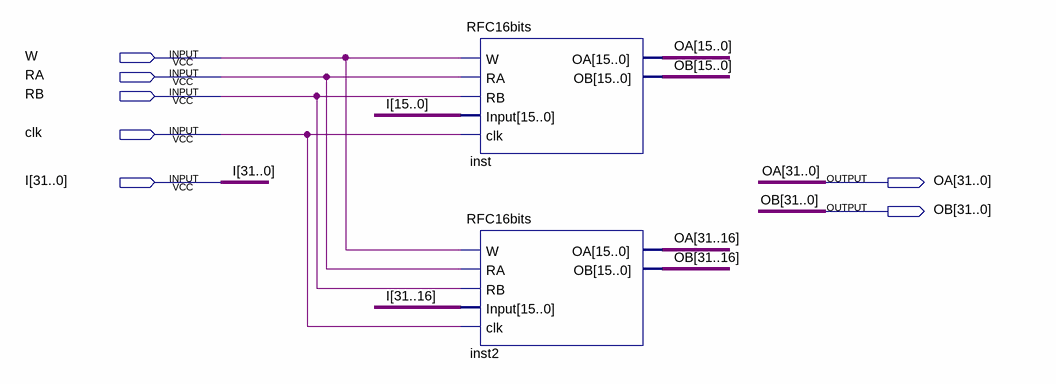
[diagram p0: schematic sheet]
// Quartus schematic RFC32bits.bdf as structural Verilog: 2 symbols, 7 pins
module RFC32bits (
  input  W,
  input  RA,
  input  RB,
  input  clk,
  input  [31:0] I,
  output [31:0] OA,
  output [31:0] OB
);

  RFC16bits inst (.W(W), .RA(RA), .RB(RB), .Input(I[15:0]), .clk(clk), .OA(OA[15:0]), .OB(OB[15:0]));
  RFC16bits inst2 (.W(W), .RA(RA), .RB(RB), .Input(I[31:16]), .clk(clk), .OA(OA[31:16]), .OB(OB[31:16]));
endmodule
